# EAGLE design bq25504 (EAGLE 7.6.0)
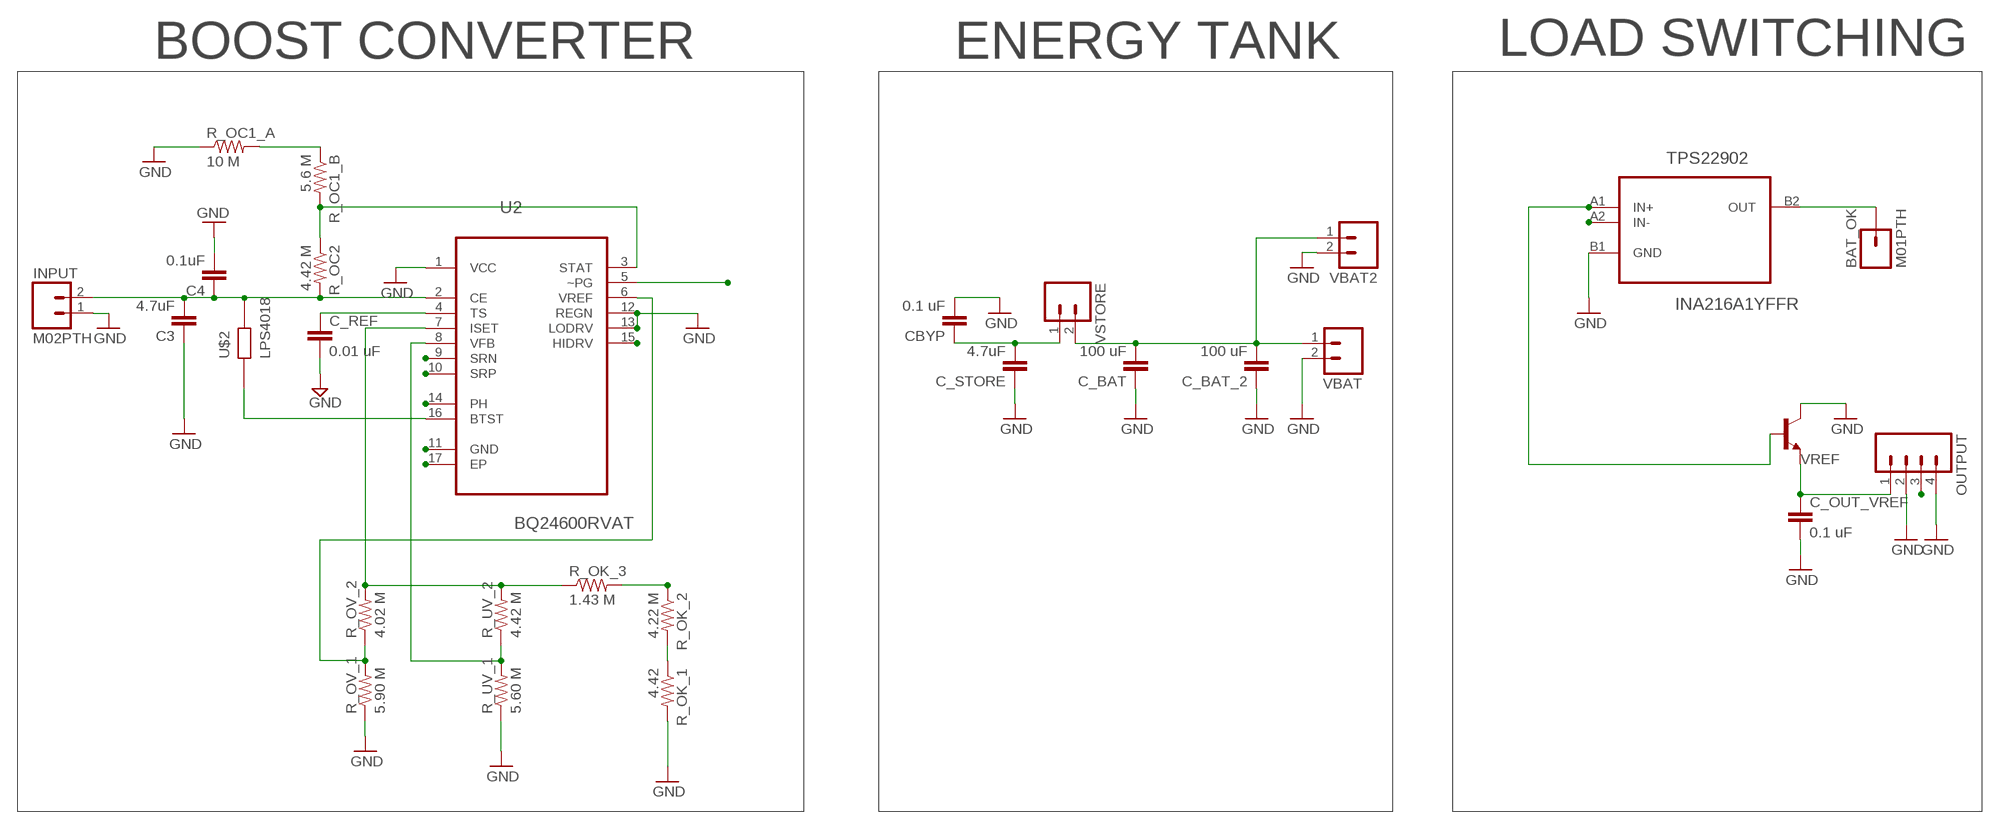
[diagram p0: schematic, sheet 1]

## Parts
BAT_OK  M01PTH  [1X01]
C3  4.7uF  1.0UF-25V-+80/-20(0805)  [0805]
C4  0.1uF  1.0UF-25V-+80/-20(0805)  [0805]
C_BAT  100 uF  CAP0805  [0805]
C_BAT_2  100 uF  CAP1210  [1210]
C_OUT_VREF  0.1 uF  12PF-50V-5%(0603)  [0603-CAP]
C_REF  0.01 uF  CAP0805  [0805]
C_STORE  4.7uF  1.0UF-25V-+80/-20(0805)  [0805]
CBYP  0.1 uF  CAP0805  [0805]
INPUT  M02PTH  [1X02]
OUTPUT  M04LOCK  [1X04_LOCK]
R_OC1_A  10 M  RESISTOR0805-RES  [0805]
R_OC1_B  5.6 M  RESISTOR0805-RES  [0805]
R_OC2  4.42 M  RESISTOR0805-RES  [0805]
R_OK_1  4.42  RESISTOR0805-RES  [0805]
R_OK_2  4.22 M  RESISTOR0805-RES  [0805]
R_OK_3  1.43 M  RESISTOR0805-RES  [0805]
R_OV_1  5.90 M  RESISTOR0805-RES  [0805]
R_OV_2  4.02 M  RESISTOR0805-RES  [0805]
R_UV_1  5.60 M  RESISTOR0805-RES  [0805]
R_UV_2  4.42 M  RESISTOR0805-RES  [0805]
TPS22902  INA216A1YFFR  [BGA4C40P2X2_76X76X63]
U2  BQ24600RVAT  [QFN50P350X350X100-17N]
U$2  LPS4018  [LPS4018]
VBAT  M02PTH  [1X02]
VBAT2  M02PTH  [1X02]
VREF_1.8  TRANSISTOR_NPNSOT23-3  [SOT23-3]
VSTORE  M02PTH  [1X02]

## Nets
9_PIN: R_OK_2.1 R_OK_3.2 U2.9(SRN)
10_PIN: R_OK_1.1 R_OK_2.2 U2.10(SRP)
BAT_OK: BAT_OK.1 TPS22902.B2(OUT) U2.11(GND)
BOOST_OUT: OUTPUT.3 TPS22902.A1(IN+) VREF_1.8.1(B)
GND: C3.1 C4.2 C_BAT.1 C_BAT_2.1 C_OUT_VREF.2 C_REF.2 C_STORE.1 CBYP.2 INPUT.1 OUTPUT.2 OUTPUT.4 R_OC1_A.1 R_OK_1.2 R_OV_1.1 R_UV_1.1 TPS22902.B1(GND) U2.1(VCC) U2.5(~PG) U2.12(REGN) U2.13(LODRV) VBAT2.2 VBAT.2 VREF_1.8.3(C)
J: U2.16(BTST) U$2.A
N$5: C3.2 C4.1 INPUT.2 R_OC2.2 U2.2(CE) U$2.B
N$9: R_OV_1.2 R_OV_2.1 U2.6(VREF)
N$11: R_OC1_B.2 R_OC2.1 U2.3(STAT)
N$13: R_UV_1.2 R_UV_2.1 U2.8(VFB)
N$14: C_REF.1 U2.4(TS)
N$15: R_OC1_A.2 R_OC1_B.1
N$16: C_OUT_VREF.1 OUTPUT.1 VREF_1.8.2(E)
N$18: U2.17(EP)
V_BAT: C_BAT.2 C_BAT_2.2 TPS22902.A2(IN-) U2.14(PH) VBAT2.1 VBAT.1 VSTORE.2
V_STORE: C_STORE.2 CBYP.1 U2.15(HIDRV) VSTORE.1
WIRE: R_OK_3.1 R_OV_2.2 R_UV_2.2 U2.7(ISET)

## Notes on the sheet
- LOAD SWITCHING
- BOOST CONVERTER | ENERGY TANK
- VREF

## Library data of the parts
BAT_OK = SparkFun:M01: Header 1 Standard 1-pin 0.1" header. Use with straight break away headers (SKU : PRT-00116), right angle break away headers (PRT-00553), swiss pins (PRT-00743), machine pins (PRT-00117), and female headers (PRT-00115).
C3 C4 C_STORE = SparkFun-Capacitors:1.0UF-25V-+80/-20(0805): CAP-11625; PROD_ID: CAP-11625; VALUE: 1.0uF
C_BAT C_REF CBYP = SparkFun:CAP: Capacitor Standard 0603 ceramic capacitor, and 0.1" leaded capacitor.
C_BAT_2 = SparkFun-Capacitors:CAP: Capacitor Standard 0603 ceramic capacitor, and 0.1" leaded capacitor.
C_OUT_VREF = SparkFun-Capacitors:12PF-50V-5%(0603): CAP-09137; PROD_ID: CAP-09137; VALUE: 12pF
INPUT = SparkFun-Connectors:M02: Standard 2-pin 0.1" header. Use with - straight break away headers ( PRT-00116) - right angle break away headers (PRT-00553) - swiss pins (PRT-00743) - machine pins (PRT-00117) - female headers (PRT-00115) Molex polarized connector foot print use with: PRT-08233 with associated crimp pins and housings. 2.54_SCREWTERM for use with PRT-10571. 3.5mm Screw Terminal footprints for PRT-08084 5mm Screw Terminal footprints for use with PRT-08432
OUTPUT = SparkFun-Connectors:M04: Header 4 Standard 4-pin 0.1" header. Use with straight break away headers (SKU : PRT-00116), right angle break away headers (PRT-00553), swiss pins (PRT-00743), machine pins (PRT-00117), and female headers (PRT-00115). Molex polarized connector foot print use with SKU : PRT-08231 with associated crimp pins and housings. 1MM SMD Version SKU: PRT-10208
R_OC1_A R_OC1_B R_OC2 R_OK_1-R_OK_3 R_OV_1 R_OV_2 R_UV_1 R_UV_2 = SparkFun-Resistors:RESISTOR: Resistor Basic schematic elements and footprints for 0603, 1206, and PTH resistors.
TPS22902 = Texas Instruments_By_element14_Batch_1:INA216A1YFFR: CURRENT SHUNT MONITOR; MPN: INA216A1YFFR; OC_FARNELL: -; OC_NEWARK: 79R8069; PACKAGE: DSBGA-4; SUPPLIER: Texas Instruments
U2 = Texas Instruments_By_element14_Batch_1:BQ24600RVAT: Synchronous Switch-Mode Li-Ion or Li-Polymer Battery Charger; MPN: BQ24600RVAT; OC_FARNELL: -; OC_NEWARK: 72R5026; PACKAGE: VQFN-16; SUPPLIER: Texas Instruments
U$2 = 3DRobotics_Master_Library:LPS4018: Coilcraft Shielded SMT power inductor 15uH inductor for LM2842 switching regulator application circuit.; DATASHEET: http://www.coilcraft.com/pdf_viewer/showpdf.cfm?f=pdf_store:lps4018.pdf; LINK: http://www.coilcraft.com/lps4018.cfm; MFGPN: LPS4018-153MLB
VBAT VBAT2 VSTORE = SparkFun:M02: Header 2 Standard 2-pin 0.1" header. Use with straight break away headers (SKU : PRT-00116), right angle break away headers (PRT-00553), swiss pins (PRT-00743), machine pins (PRT-00117), and female headers (PRT-00115). Molex polarized connector foot print use with SKU : PRT-08233 with associated crimp pins and housings.
VREF_1.8 = SparkFun:TRANSISTOR_NPN: Transistor NPN BJT configuration in SOT23 package. MMBT2222 is the common NPN we use. Double check BCE configuration again layout.

## Board
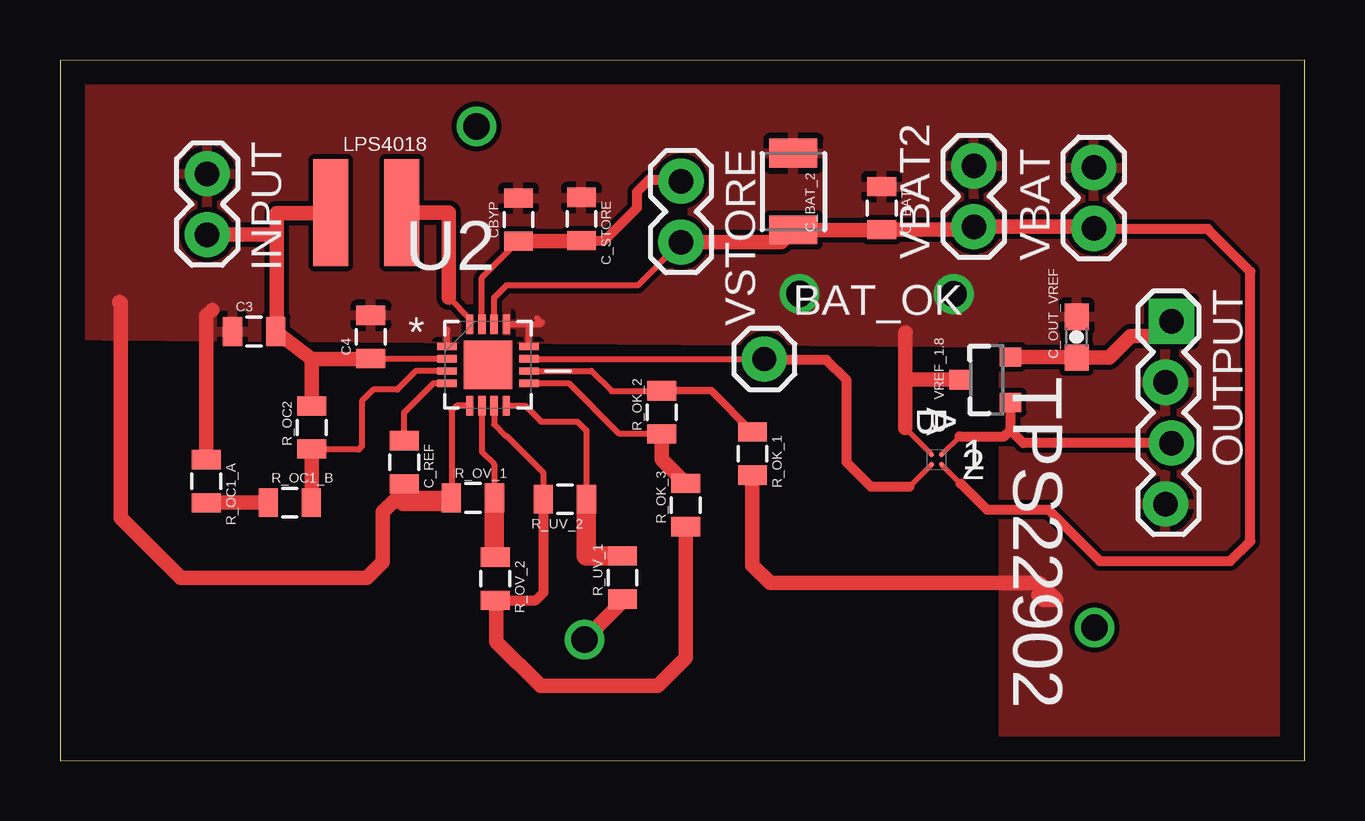
[diagram p1: board, top side]
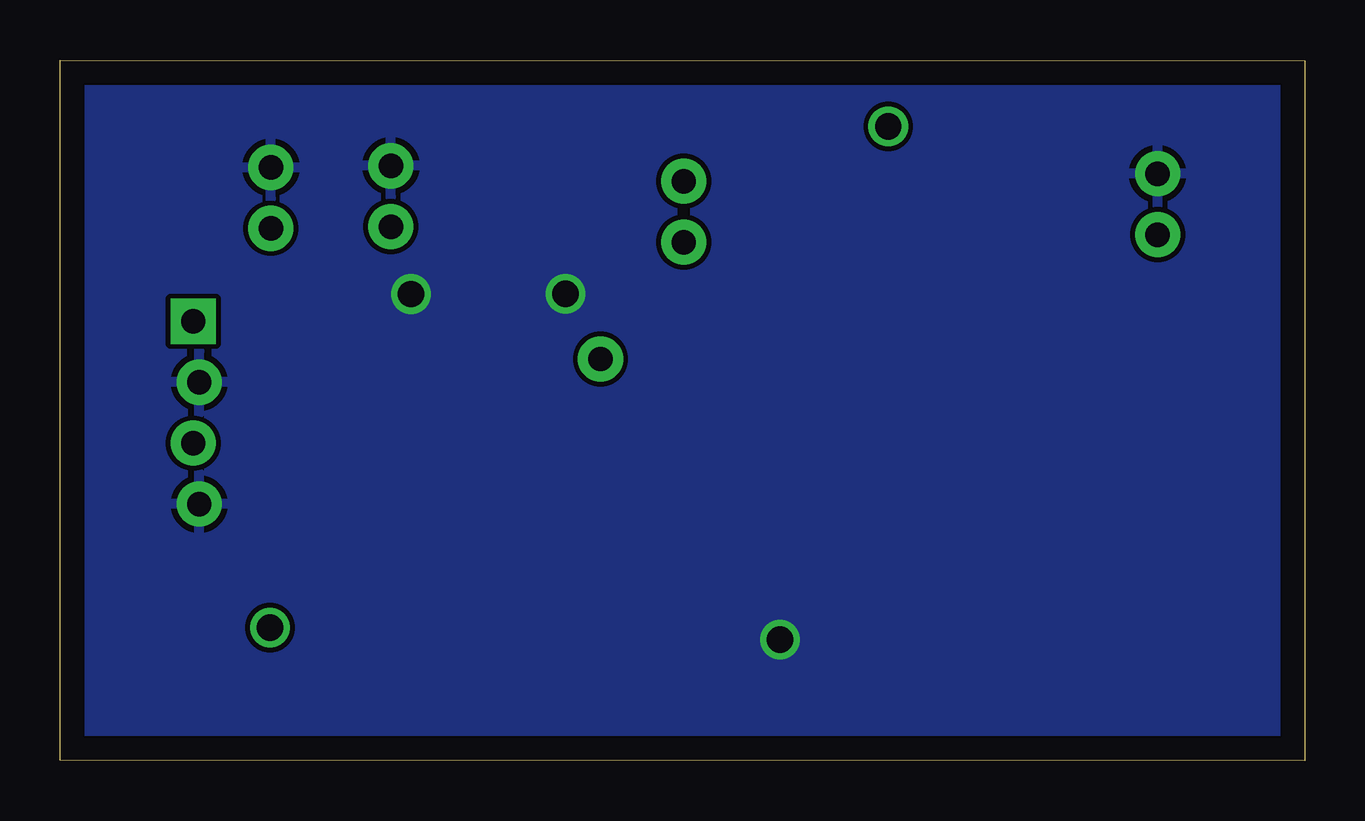
[diagram p2: board, bottom side, seen from below]

Size 51.86 x 29.22 mm. Coordinates in mm from the lower left corner, seen from the top.
Outline: 0,0 51.86,0.02 51.86,29.22 0,29.2 0,0
Copper layers (1*16): Top 0.035mm / dielectric 1.5mm / Bottom 0.035mm
Design rules "default *": minimum track width 8mil, minimum drill 24mil, track to track 8mil, track to pad 8mil, pad to pad 8mil, via to via 8mil, smd to smd 8mil, copper to edge 40mil, drill to drill 8mil, minimum pad ring 10mil, minimum via ring 8mil, stop-mask expansion 4mil, vias tented up to drill 0mil, thermal gap 10mil

### Footprints (pad centres in the part's own frame; a part is rotated, then mirrored left to right if it is on the bottom)
1X01 = drill 1.016 pad 1.88: 1 0,0
0805 = smd 0.8 x 1.2: 1 -0.9,0; 2 0.9,0
1210 = smd 1.2 x 2: 1 -1.6,0; 2 1.6,0
0603-CAP = smd 1.1 x 1: 1 -0.85,0; 2 0.85,0
1X02 = drill 1.016 pad 1.88: 1 0,0; 2 2.54,0
1X04_LOCK = drill 1.016 pad 1.88 square: 1 0,0.127 | drill 1.016 pad 1.88: 2 2.54,-0.127; 3 5.08,0.127; 4 7.62,-0.127
BGA4C40P2X2_76X76X63 = smd 0.203 x 0.203: A1 -0.203,0.203; A2 0.203,0.203; B1 -0.203,-0.203; B2 0.203,-0.203
QFN50P350X350X100-17N = smd 0.813 x 0.305: 1 -1.702,0.762; 2 -1.702,0.254; 3 -1.702,-0.254; 4 -1.702,-0.762; 9 1.702,-0.762; 10 1.702,-0.254; 11 1.702,0.254; 12 1.702,0.762 | smd 0.305 x 0.813: 5 -0.762,-1.702; 6 -0.254,-1.702; 7 0.254,-1.702; 8 0.762,-1.702; 13 0.762,1.702; 14 0.254,1.702; 15 -0.254,1.702; 16 -0.762,1.702 | smd 2.032 x 2.032: 17 0,0
LPS4018 = smd 1.448 x 4.445: A -1.482,0; B 1.469,0
SOT23-3 = smd 0.8 x 0.9: 1 -0.95,-1; 2 0.95,-1; 3 0,1.1

### Placement (x,y rotation side)
BAT_OK  29.34,16.75 0 top
C3  8.09,17.91 0 top
C4  12.95,17.68 90 top
C_BAT  34.23,23.05 270 top
C_BAT_2  30.56,23.74 270 top
C_OUT_VREF  42.35,17.67 90 top
C_REF  14.34,12.45 270 top
C_STORE  21.73,22.59 270 top
CBYP  19.1,22.57 90 top
INPUT  6.13,24.48 270 top
OUTPUT  46.19,18.33 270 top
R_OC1_A  6.1,11.65 270 top
R_OC1_B  9.57,10.77 0 top
R_OC2  10.49,13.9 90 top
R_OK_1  28.85,12.81 270 top
R_OK_2  25.07,14.53 90 top
R_OK_3  26.07,10.66 90 top
R_OV_1  17.21,10.96 0 top
R_OV_2  18.13,7.59 270 top
R_UV_1  23.44,7.64 90 top
R_UV_2  21.04,10.91 180 top
TPS22902  36.52,12.56 270 top
U2  17.83,16.51 0 top
U$2  12.75,22.86 180 top
VBAT  43.08,22.2 90 top
VBAT2  38.08,22.27 90 top
VREF_1.8  38.61,15.89 90 top
VSTORE  25.87,24.17 270 top

### Tracks (layer width: path | path; a pad name or v marks a point on that pad's centre or on a via)
9_PIN
  Top 0.254: U2.9 21.19,15.75 23.28,13.66 25.05,13.66 R_OK_2.1
  Top 0.61: R_OK_2.1 25.08,12.56 R_OK_3.2
10_PIN
  Top 0.254: U2.10 22.14,16.26 22.98,15.42 25.06,15.42 R_OK_2.2
  Top 0.305: R_OK_2.2 27.13,15.43 R_OK_1.1
BAT_OK
  Top 0.203: TPS22902.B2 35.39,11.42
  Top 0.254: U2.11 29.33,16.76 BAT_OK.1
  Top 0.406: 35.39,11.42 33.8,11.42 32.77,12.45 32.77,15.88 31.93,16.72 29.38,16.72 BAT_OK.1
BOOST_OUT
  Top 0.203: TPS22902.A1 37.49,13.53
  Top 0.406: 37.49,13.53 39.35,13.53 39.61,13.78 | 39.61,13.78 VREF_1.8.1 | OUTPUT.3 40.14,13.25 39.61,13.78
GND  (via drill 1.1)
  Top 0.203: TPS22902.B1 | TPS22902.B1 35.21,13.87
  Top 0.254: U2.1 16.14,17.97 | U2.13 19.57,18.21 | 19.57,18.21 20.01,18.21 20.08,18.28 20.04,18.28 19.88,18.45 | U2.12 19.54,18.18 19.57,18.21 | R_OV_1.1 16.32,10.97 16.32,14.59 16.53,14.81 U2.5
  Top 0.61: R_OC1_A.1 6.1,18.56 6.33,18.8 | 16.32,10.97 14.05,10.97 13.45,10.37 13.45,8.29 12.79,7.62 5.03,7.62 2.52,10.13 2.52,19.09 2.48,19.14 | R_UV_1.1 23.44,6.64 v21.86,5.06 | 35.21,13.87 35.21,16.05 | 35.21,16.05 35.21,17.84 35.23,17.86 | VREF_1.8.3 35.37,15.89 35.21,16.05 | R_OK_1.2 28.85,8.15 29.59,7.42 40.81,7.42 41.51,6.72 40.97,6.72 40.76,6.93
  Top 0.813: C_REF.2 14.34,10.84 14.32,10.82 16.17,10.82 R_OV_1.1
  other vias: 30.81,19.47 37.24,19.46
  pour Top: -6.3,30.48 -6.3,17.8 39.29,17.45 39.29,0 59.74,0 59.74,30.48
  pour Bottom: -2.49,29.21 -2.49,-1.27 61.01,-1.27 61.01,29.21
J
  Top 0.254: U2.16 17.07,18.43 16.19,19.31
  Top 0.61: U$2.A 16.19,22.86 16.19,22.54 16.19,19.31
N$4  (via drill 1.1)
  other vias: 17.36,26.45
N$5
  Top 0.254: U2.2 12.95,16.76 C4.1
  Top 0.61: 12.95,16.76 10.49,16.76 | 10.49,16.76 C3.2 9.03,17.9 9.03,21.9 9.03,21.94 | R_OC2.2 10.49,16.76 | 9.03,21.94 9.03,22.84 11.28,22.84 U$2.B | INPUT.2 9.03,21.94
N$6  (via drill 1.1)
  other vias: 43.11,5.55
N$9
  Top 0.254: U2.6 17.58,12.88 18.09,12.38 18.09,10.98 R_OV_1.2
  Top 0.813: 18.09,10.98 18.09,8.54 R_OV_2.1
N$11
  Top 0.254: U2.3 14.83,16.26 14.05,15.48 13.06,15.48 12.58,15 12.58,13.12 12.44,12.98 10.52,12.98 R_OC2.1
  Top 0.61: R_OC2.1 10.49,10.79 R_OC1_B.2
N$13
  Top 0.254: U2.8 19.38,14.81 20.04,14.14 21.56,14.14 21.93,13.78 21.93,10.92 R_UV_2.1
  Top 0.813: 21.93,10.92 21.93,8.54 R_UV_1.2
N$14
  Top 0.254: C_REF.1 14.34,14.52 15.57,15.75 U2.4
N$15
  Top 0.61: R_OC1_B.1 6.11,10.77 R_OC1_A.2
N$16
  Top 0.61: VREF_1.8.2 42.33,16.84 C_OUT_VREF.1 43.72,16.82 44.62,17.72 45.71,17.72 OUTPUT.1
V_BAT
  Top 0.203: TPS22902.A2 37.53,11.55
  Top 0.254: U2.14 18.09,19.31 18.61,19.83 24.08,19.83 VSTORE.2
  Top 0.406: 37.53,11.55 37.54,11.55 38.62,10.48 41.18,10.48 43.33,8.33 48.77,8.33 49.6,9.16 49.6,20.4 47.82,22.18 43.1,22.18 VBAT.1
  Top 0.61: VSTORE.2 30.05,21.63 C_BAT_2.2 34.23,22.14 C_BAT.2 37.95,22.14 VBAT2.1 43.01,22.27 VBAT.1
V_STORE
  Top 0.254: U2.15 17.58,20.14 CBYP.1
  Top 0.406: C_STORE.2 22.67,21.69 24.04,23.07 24.04,23.73 24.55,24.24 25.8,24.24 VSTORE.1
  Top 0.61: CBYP.1 21.7,21.67 C_STORE.2
WIRE
  Top 0.254: U2.7 18.09,14.04 18.6,13.53 18.63,13.53 20.13,12.03 R_UV_2.2
  Top 0.406: R_OV_2.2 19.83,6.7 20.16,7.02 20.16,10.9 R_UV_2.2
  Top 0.61: R_OK_3.1 26.07,4.29 24.9,3.12 20.03,3.12 18.18,4.97 18.18,6.65 R_OV_2.2